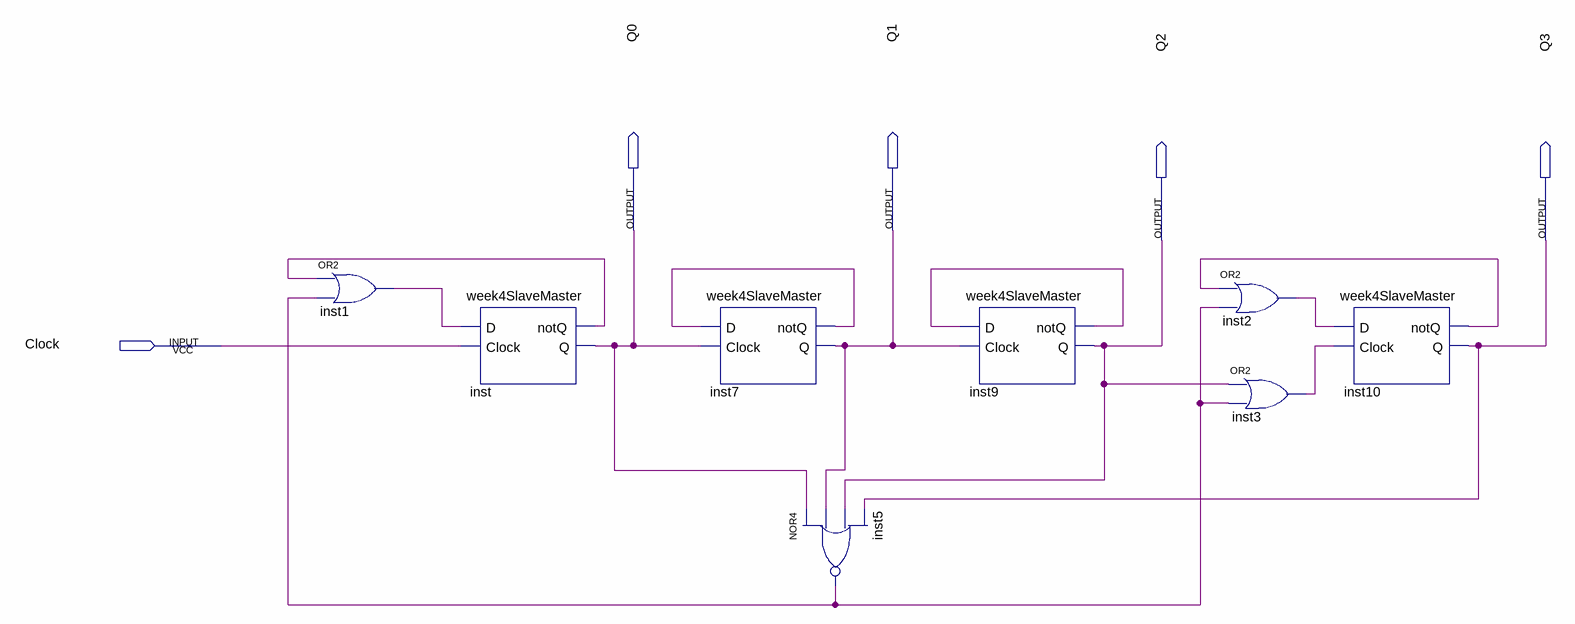
[diagram p0: schematic sheet]
// Quartus schematic week5part2.bdf as structural Verilog: 8 symbols, 5 pins
module week5part2 (
  input  Clock,
  output Q0,
  output Q1,
  output Q2,
  output Q3
);

  wire inst1_out, inst2_out, inst3_out, inst5_out, inst7_notq, inst9_notq, inst10_notq, inst_notq;

  or inst1 (inst1_out, inst_notq, inst5_out);
  week4SlaveMaster inst (.D(inst1_out), .Clock(Clock), .notQ(inst_notq), .Q(Q0));
  week4SlaveMaster inst7 (.D(inst7_notq), .Clock(Q0), .notQ(inst7_notq), .Q(Q1));
  nor inst5 (inst5_out, Q0, Q1, Q2, Q3);
  week4SlaveMaster inst9 (.D(inst9_notq), .Clock(Q1), .notQ(inst9_notq), .Q(Q2));
  or inst2 (inst2_out, inst10_notq, inst5_out);
  or inst3 (inst3_out, Q2, inst5_out);
  week4SlaveMaster inst10 (.D(inst2_out), .Clock(inst3_out), .notQ(inst10_notq), .Q(Q3));
endmodule
